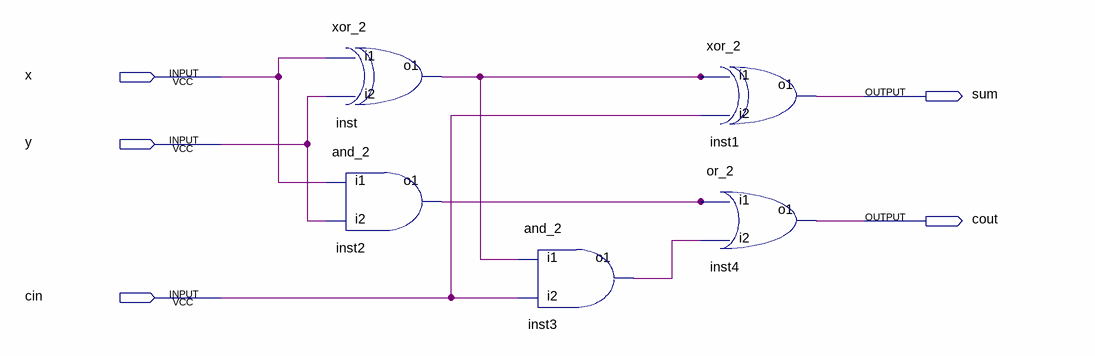
[diagram p0: schematic sheet]
// Quartus schematic fulladder1.bdf as structural Verilog: 5 symbols, 5 pins
module fulladder1 (
  input  x,
  input  y,
  input  cin,
  output sum,
  output cout
);

  wire inst2_o1, inst3_o1, inst_o1;

  xor_2 inst (.i1(x), .i2(y), .o1(inst_o1));
  and_2 inst2 (.i1(x), .i2(y), .o1(inst2_o1));
  and_2 inst3 (.i1(inst_o1), .i2(cin), .o1(inst3_o1));
  xor_2 inst1 (.i1(inst_o1), .i2(cin), .o1(sum));
  or_2 inst4 (.i1(inst2_o1), .i2(inst3_o1), .o1(cout));
endmodule
